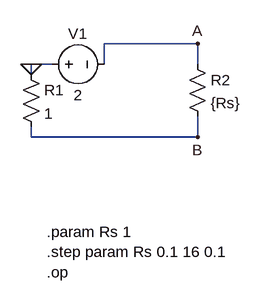
[diagram p0: schematic DependenteRezistenta.asc]
DependenteRezistenta.asc, the LTspice schematic file:
Version 4
SHEET 1 880 680
WIRE 304 112 160 112
WIRE 80 144 48 144
WIRE 160 144 160 112
WIRE 304 144 304 112
WIRE 48 160 48 144
WIRE 48 256 48 240
WIRE 304 256 304 224
WIRE 304 256 48 256
FLAG 48 144 0
FLAG 304 112 A
FLAG 304 256 B
SYMBOL voltage 64 144 R270
WINDOW 0 32 56 VTop 2
WINDOW 3 -32 56 VBottom 2
SYMATTR InstName V1
SYMATTR Value 2
SYMBOL res 32 144 R0
SYMATTR InstName R1
SYMATTR Value 1
SYMBOL res 288 128 R0
SYMATTR InstName R2
SYMATTR Value {Rs}
TEXT 72 402 Left 2 !.param Rs 1\n.step param Rs 0.1 16 0.1\n.op

The netlist it stands for:
* DependenteRezistenta.asc
V1 0 A 2
R1 0 B 1
R2 A B {Rs}
.param Rs 1
.step param Rs 0.1 16 0.1
.op
.backanno
.end